# Altium project capstone_pcb.PrjPcb (part 2 of 2)

## Sheet comparator.SchDoc
size A
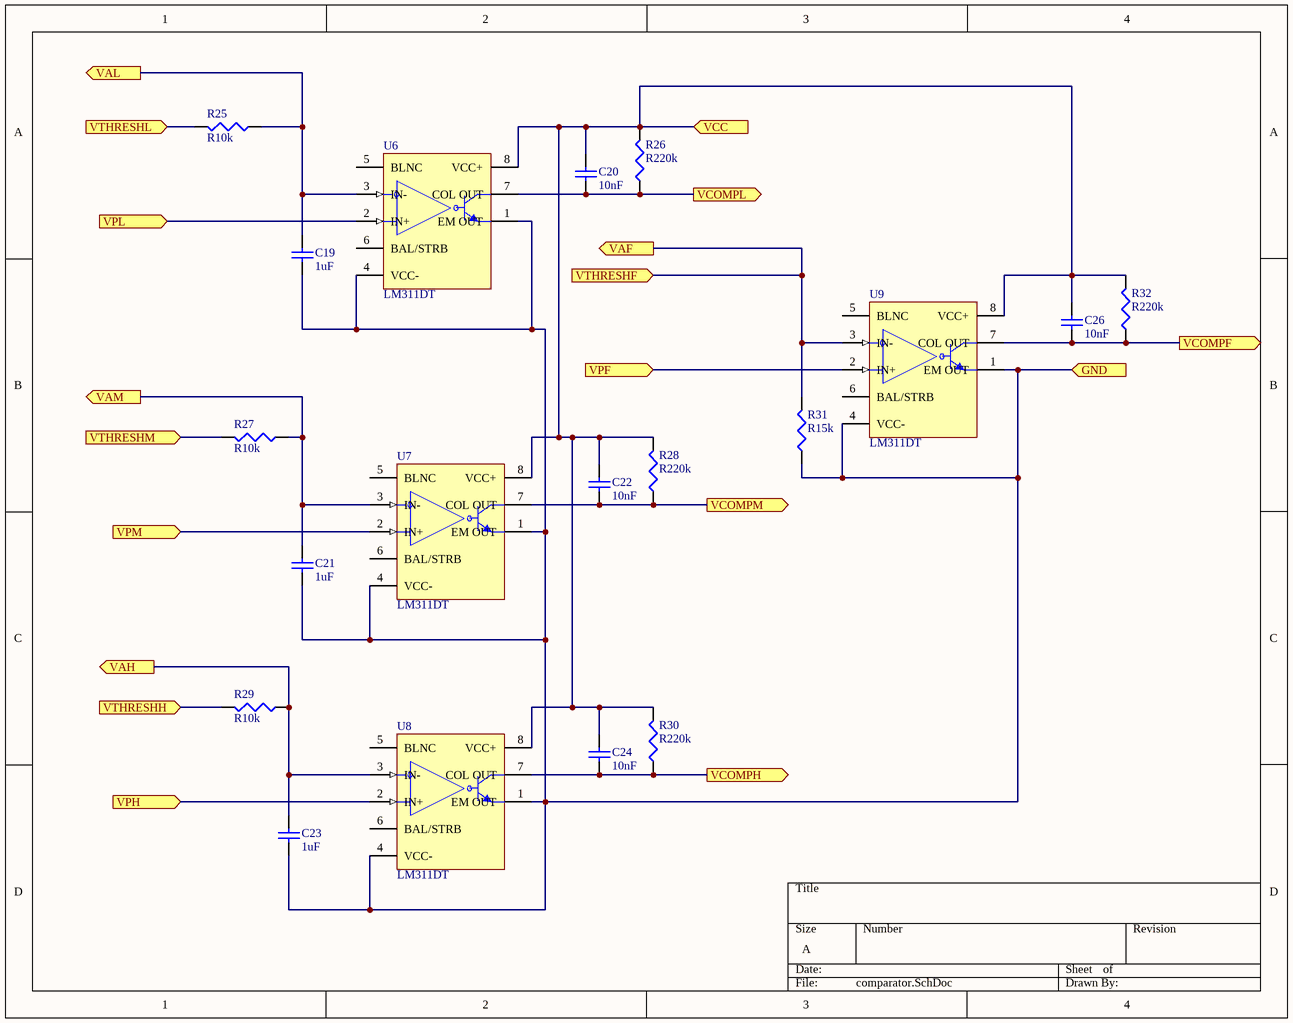
[diagram p6: comparator.SchDoc]

### Parts
C19  1uF  [C0603]
C20  10nF  [C0603]
C21  1uF  [C0603]
C22  10nF  [C0603]
C23  1uF  [C0603]
C24  10nF  [C0603]
C26  10nF  [C0603]
R25  R10k  [R0603]
R26  R220k  [R0603]
R27  R10k  [R0603]
R28  R220k  [R0603]
R29  R10k  [R0603]
R30  R220k  [R0603]
R31  R15k  [R0603]
R32  R220k  [R0603]
U6  LM311DT  [soic8]
U7  LM311DT  [soic8]
U8  LM311DT  [soic8]
U9  LM311DT  [soic8]

### Ports
GND (in), VAF (out), VAH (out), VAL (out), VAM (out), VCC (in), VCOMPF (out), VCOMPH (out), VCOMPL (out), VCOMPM (out), VPF (in), VPH (in), VPL (in), VPM (in), VTHRESHF (in), VTHRESHH (in), VTHRESHL (in), VTHRESHM (in)

### Nets
GND: C19.2 C21.2 C23.2 R31.1 U6.1(EM_OUT) U6.4(VCC-) U7.1(EM_OUT) U7.4(VCC-) U8.1(EM_OUT) U8.4(VCC-) U9.1(EM_OUT) U9.4(VCC-) ; port GND
VCC: C20.1 C22.1 C24.1 C26.1 R26.2 R28.2 R30.2 R32.2 U6.8(VCC+) U7.8(VCC+) U8.8(VCC+) U9.8(VCC+) ; port VCC
NetC19_1: C19.1 R25.1 U6.3(IN-) ; port VAL
NetC20_2: C20.2 R26.1 U6.7(COL_OUT) ; port VCOMPL
NetC21_1: C21.1 R27.1 U7.3(IN-) ; port VAM
NetC22_2: C22.2 R28.1 U7.7(COL_OUT) ; port VCOMPM
NetC23_1: C23.1 R29.1 U8.3(IN-) ; port VAH
NetC24_2: C24.2 R30.1 U8.7(COL_OUT) ; port VCOMPH
NetC26_2: C26.2 R32.1 U9.7(COL_OUT) ; port VCOMPF
NetC27_1: U6.2(IN+) ; port VPL
NetC28_1: U7.2(IN+) ; port VPM
NetC29_1: U8.2(IN+) ; port VPH
NetC30_1: U9.2(IN+) ; port VPF
NetR25_2: R25.2 ; port VTHRESHL
NetR27_2: R27.2 ; port VTHRESHM
NetR29_2: R29.2 ; port VTHRESHH
NetR31_2: R31.2 U9.3(IN-) ; port VTHRESHF, port VAF

Not connected (* = marked no-connect by the designer): U6 5(BLNC) 6(BAL/STRB); U7 5(BLNC) 6(BAL/STRB); U8 5(BLNC) 6(BAL/STRB); U9 5(BLNC) 6(BAL/STRB)

### Library data of the parts
C19 C21 C23 = C1uF: 1 uF Surface Mount Capacitor; Manufacturer: Murata Electronics North America; Manufacturer Part Number: GRM188R61C105KA93D; Capacitance: 1µF; Tolerance: ±10%; Voltage - Rated: 16V; Temperature Coefficient: X5R; Supplier 1: Digi-Key; RoHS: RoHS Compliant; Category: Capacitors; Stock 1: 1349645; Pricing 1: 1=0.1, 10=0.034, 50=0.0182, 100=0.0154, 250=0.0126, 500=0.01078, 1000=0.0084 (USD); Packaging: Digi-Reel®; Part Status: Active; Operating Temperature: -55°C ~ 85°C; Features: -; Ratings: -; Applications: General Purpose; Mounting Type: Surface Mount, MLCC; Package / Case: 0603 (1608 Metric); Size / Dimension: 0.063" L x 0.031" W (1.60mm x 0.80mm); Height - Seated (Max): -; Thickness (Max): 0.035" (0.90mm); Lead Spacing: -; Lead Style: -; ComponentLink1URL: http://www.murata.com/~/media/webrenewal/support/library/catalog/products/capacitor/mlcc/c02e.pdf; ComponentLink1Description: http://www.murata.com/~/media/webrenewal/support/library/catalog/products/capacitor/mlcc/c02e.pdf; Supplier Part Number 1: 490-1536-6-ND
C20 C22 C24 C26 = C10nF: 10 nF Surface Mount Capacitor; Manufacturer: Murata Electronics North America; Manufacturer Part Number: GRM188R70J103KA01D; Capacitance: 10000pF; Tolerance: ±10%; Voltage - Rated: 6.3V; Temperature Coefficient: X7R; Supplier 1: Digi-Key; RoHS: RoHS Compliant; Category: Capacitors; Stock 1: 37902; Pricing 1: 1=0.1, 10=0.049, 50=0.0266, 100=0.0226, 250=0.01844, 500=0.01578, 1000=0.0123 (USD); Packaging: Digi-Reel®; Part Status: Active; Operating Temperature: -55°C ~ 125°C; Features: -; Ratings: -; Applications: General Purpose; Mounting Type: Surface Mount, MLCC; Package / Case: 0603 (1608 Metric); Size / Dimension: 0.063" L x 0.031" W (1.60mm x 0.80mm); Height - Seated (Max): -; Thickness (Max): 0.035" (0.90mm); Lead Spacing: -; Lead Style: -; ComponentLink1URL: http://www.murata.com/~/media/webrenewal/support/library/catalog/products/capacitor/mlcc/c02e.pdf; ComponentLink1Description: http://www.murata.com/~/media/webrenewal/support/library/catalog/products/capacitor/mlcc/c02e.pdf; Supplier Part Number 1: 490-9729-6-ND
R25 R27 R29 = R10k: 10k Ohms Surface Mount Resistor; Manufacturer: Yageo; Manufacturer Part Number: RC0603FR-0710KL; Tolerance: ±1%; Power (Watts): 0.1W, 1/10W; Temperature Coefficient: ±100ppm/°C; Supplier 1: Digi-Key; RoHS: RoHS Compliant; Category: Resistors; Stock 1: 15519632; Pricing 1: 1=0.1, 10=0.013, 25=0.0092, 50=0.007, 100=0.0052, 250=0.00396, 500=0.00316, 1000=0.00233 (USD); Packaging: Digi-Reel®; Part Status: Active; Resistance (Ohms): 10k; Composition: Thick Film; Features: Moisture Resistant; Operating Temperature: -55°C ~ 155°C; Package / Case: 0603 (1608 Metric); Supplier Device Package: 0603; Size / Dimension: 0.063" L x 0.031" W (1.60mm x 0.80mm); Height - Seated (Max): 0.022" (0.55mm); Number of Terminations: 2; Failure Rate: -; ComponentLink1URL: http://www.yageo.com/NewPortal/yageodocoutput?fileName=/pdf/R-Chip/PYu-RC_Group_51_RoHS_L_4.pdf; ComponentLink1Description: http://www.yageo.com/NewPortal/yageodocoutput?fileName=/pdf/R-Chip/PYu-RC_Group_51_RoHS_L_4.pdf; Supplier Part Number 1: 311-10.0KHRDKR-ND
R26 R28 R30 R32 = R220k: 220k Ohms Surface Mount Resistor; Manufacturer: Yageo; Manufacturer Part Number: RC0603FR-07220KL; Tolerance: ±1%; Power (Watts): 0.1W, 1/10W; Temperature Coefficient: ±100ppm/°C; Supplier 1: Digi-Key; RoHS: RoHS Compliant; Category: Resistors; Stock 1: 712768; Pricing 1: 1=0.1, 10=0.013, 25=0.0092, 50=0.007, 100=0.0052, 250=0.00396, 500=0.00316, 1000=0.00233 (USD); Packaging: Digi-Reel®; Part Status: Active; Resistance (Ohms): 220k; Composition: Thick Film; Features: Moisture Resistant; Operating Temperature: -55°C ~ 155°C; Package / Case: 0603 (1608 Metric); Supplier Device Package: 0603; Size / Dimension: 0.063" L x 0.031" W (1.60mm x 0.80mm); Height - Seated (Max): 0.022" (0.55mm); Number of Terminations: 2; Failure Rate: -; ComponentLink1URL: http://www.yageo.com/NewPortal/yageodocoutput?fileName=/pdf/R-Chip/PYu-RC_Group_51_RoHS_L_4.pdf; ComponentLink1Description: http://www.yageo.com/NewPortal/yageodocoutput?fileName=/pdf/R-Chip/PYu-RC_Group_51_RoHS_L_4.pdf; Supplier Part Number 1: 311-220KHRDKR-ND
R31 = R15k: 15k Ohms Surface Mount Resistor; Manufacturer: Yageo; Manufacturer Part Number: RC0603FR-0715KL; Tolerance: ±1%; Power (Watts): 0.1W, 1/10W; Temperature Coefficient: ±100ppm/°C; Supplier 1: Digi-Key; RoHS: RoHS Compliant; Category: Resistors; Stock 1: 489455; Pricing 1: 1=0.1, 10=0.013, 25=0.0092, 50=0.007, 100=0.0052, 250=0.00396, 500=0.00316, 1000=0.00233 (USD); Packaging: Digi-Reel®; Part Status: Active; Resistance (Ohms): 15k; Composition: Thick Film; Features: Moisture Resistant; Operating Temperature: -55°C ~ 155°C; Package / Case: 0603 (1608 Metric); Supplier Device Package: 0603; Size / Dimension: 0.063" L x 0.031" W (1.60mm x 0.80mm); Height - Seated (Max): 0.022" (0.55mm); Number of Terminations: 2; Failure Rate: -; ComponentLink1URL: http://www.yageo.com/NewPortal/yageodocoutput?fileName=/pdf/R-Chip/PYu-RC_Group_51_RoHS_L_4.pdf; ComponentLink1Description: http://www.yageo.com/NewPortal/yageodocoutput?fileName=/pdf/R-Chip/PYu-RC_Group_51_RoHS_L_4.pdf; Supplier Part Number 1: 311-15.0KHRDKR-ND
U6-U9 = LM311DT: IC Comparator; Manufacturer: STMicroelectronics; Number of Elements: 1; Output Type: DTL, MOS, Open-Collector, Open-Emitter, RTL, TTL; Voltage - Supply, Single/Dual (±): 5 V ~ 30 V, ±2.5 V ~ 15 V; Voltage - Input Offset (Max): 7.5mV @ ±15V; Current - Input Bias (Max): 0.25µA @ ±15V; Current - Output (Typ): 50mA; Current - Quiescent (Max): 7.5mA; Supplier 1: Digi-Key; Manufacturer Part Number: LM311DT; RoHS: RoHS Compliant; Category: Integrated Circuits (ICs); Stock 1: 9481; Pricing 1: 1=0.39, 10=0.315, 100=0.2142, 500=0.16068, 1000=0.12051 (USD); Packaging: Cut Tape (CT); Part Status: Active; Type: General Purpose; CMRR, PSRR (Typ): -; Propagation Delay (Max): -; Hysteresis: -; Operating Temperature: 0°C ~ 70°C; Package / Case: 8-SOIC (0.154", 3.90mm Width); Mounting Type: Surface Mount; Supplier Device Package: 8-SO; ComponentLink1URL: http://www.st.com/content/ccc/resource/technical/document/datasheet/2d/22/50/0e/7e/39/43/64/CD00001072.pdf/files/CD00001072.pdf/jcr:content/translations/en.CD00001072.pdf; ComponentLink1Description: http://www.st.com/content/ccc/resource/technical/document/datasheet/2d/22/50/0e/7e/39/43/64/CD00001072.pdf/files/CD00001072.pdf/jcr:content/translations/en.CD00001072.pdf; Supplier Part Number 1: 497-1569-1-ND

## Sheet microphone_stage.SchDoc
size A
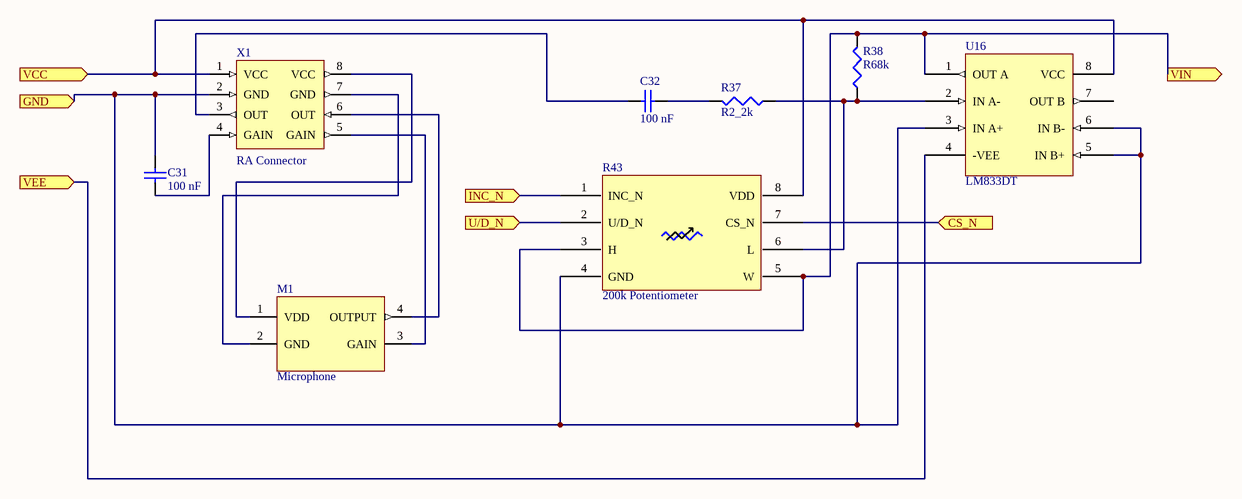
[diagram p7: microphone_stage.SchDoc]

### Parts
C31  100 nF  [C0603]
C32  100 nF  [C0603]
M1  Microphone  [SPU0414HR5H-SB-7]
R37  R2_2k  [R0603]
R38  R68k  [R0603]
R43  200k Potentiometer  [8-TSSOP]
U16  LM833DT  [soic8]
X1  RA Connector  [951104-7622-AR]

### Ports
CS_N (in), GND (in), INC_N (in), U/D_N (in), VCC (in), VEE (in), VIN (out)

### Nets
GND: C31.2 R43.4(GND) U16.3(IN_A+) U16.5(IN_B+) U16.6(IN_B-) X1.2(GND) ; port GND
VCC: R43.8(VDD) U16.8(VCC) X1.1(VCC) ; port VCC
NetC18_1: U16.4(-VEE) ; port VEE
NetC31_1: C31.1 X1.4(GAIN)
NetC32_1: C32.1 X1.3(OUT)
NetC32_2: C32.2 R37.2
NetM1_1: M1.1(VDD) X1.8(VCC)
NetM1_2: M1.2(GND) X1.7(GND)
NetM1_3: M1.3(GAIN) X1.5(GAIN)
NetM1_4: M1.4(OUTPUT) X1.6(OUT)
NetR1_1: R38.2 R43.3(H) R43.5(W) U16.1(OUT_A) ; port VIN
NetR37_1: R37.1 R38.1 R43.6(L) U16.2(IN_A-)
NetR43_1: R43.1(INC_N) ; port INC_N
NetR43_2: R43.2(U/D_N) ; port U/D_N
NetR43_7: R43.7(CS_N) ; port CS_N

Not connected (* = marked no-connect by the designer): U16 7(OUT_B)

### Library data of the parts
C31 C32 = C100nF: 100 nF Surface Mount Capacitor; Manufacturer: Murata Electronics North America; Manufacturer Part Number: GRM188R71C104KA01D; Capacitance: 0.10µF; Tolerance: ±10%; Voltage - Rated: 16V; Temperature Coefficient: X7R; Supplier 1: Digi-Key; RoHS: RoHS Compliant; Category: Capacitors; Stock 1: 4165009; Pricing 1: 1=0.1, 10=0.019, 50=0.0102, 100=0.0086, 250=0.00704, 500=0.006, 1000=0.00468 (USD); Packaging: Digi-Reel®; Part Status: Active; Operating Temperature: -55°C ~ 125°C; Features: -; Ratings: -; Applications: General Purpose; Mounting Type: Surface Mount, MLCC; Package / Case: 0603 (1608 Metric); Size / Dimension: 0.063" L x 0.031" W (1.60mm x 0.80mm); Height - Seated (Max): -; Thickness (Max): 0.035" (0.90mm); Lead Spacing: -; Lead Style: -; ComponentLink1URL: http://www.murata.com/~/media/webrenewal/support/library/catalog/products/capacitor/mlcc/c02e.pdf; ComponentLink1Description: http://www.murata.com/~/media/webrenewal/support/library/catalog/products/capacitor/mlcc/c02e.pdf; Supplier Part Number 1: 490-1532-6-ND
M1 = SPU0414HR5H-SB-7: MIC MEMS ANALOG OMNI -22DB; Manufacturer: Knowles; Direction: Omnidirectional; Frequency Range: 100Hz ~ 10kHz; Sensitivity: -22dB ±3dB @ 94dB SPL; S/N Ratio: 59dB; Impedance: 400 Ohm; Voltage Range: 1.5 ~ 3.6V; Current - Supply: 220µA; Port Location: Top; Seal Rating: None; Shape: Rectangular; Supplier 1: Digi-Key; Manufacturer Part Number: SPU0414HR5H-SB-7; RoHS: RoHS Compliant; Category: Audio Products; Stock 1: 124760; Pricing 1: 1=2.01, 10=1.748, 25=1.3596, 50=1.23, 100=1.1005, 250=1.06812, 500=1.03576, 1000=0.93866 (USD); Packaging: Digi-Reel®; Part Status: Active; Type: MEMS (Silicon); Output Type: Analog; Voltage - Rated: -; Termination: Surface Mount; Size / Dimension: 3.76mm L x 2.95mm W; Height (Max): 1.20mm; ComponentLink1URL: http://www.knowles.com/eng/content/download/3915/49630/version/7/file/SPU0414HR5H-SB.pdf; ComponentLink1Description: http://www.knowles.com/eng/content/download/3915/49630/version/7/file/SPU0414HR5H-SB.pdf; Supplier Part Number 1: 423-1134-6-ND
R37 = R2_2k: 2.2k Ohms Surface Mount Resistor; Manufacturer: Yageo; Manufacturer Part Number: RC0603FR-072K2L; Tolerance: ±1%; Power (Watts): 0.1W, 1/10W; Temperature Coefficient: ±100ppm/°C; Supplier 1: Digi-Key; RoHS: RoHS Compliant; Category: Resistors; Stock 1: 4524664; Pricing 1: 1=0.1, 10=0.013, 25=0.0092, 50=0.007, 100=0.0052, 250=0.00396, 500=0.00316, 1000=0.00233 (USD); Packaging: Digi-Reel®; Part Status: Active; Resistance (Ohms): 2.2k; Composition: Thick Film; Features: Moisture Resistant; Operating Temperature: -55°C ~ 155°C; Package / Case: 0603 (1608 Metric); Supplier Device Package: 0603; Size / Dimension: 0.063" L x 0.031" W (1.60mm x 0.80mm); Height - Seated (Max): 0.022" (0.55mm); Number of Terminations: 2; Failure Rate: -; ComponentLink1URL: http://www.yageo.com/NewPortal/yageodocoutput?fileName=/pdf/R-Chip/PYu-RC_Group_51_RoHS_L_4.pdf; ComponentLink1Description: http://www.yageo.com/NewPortal/yageodocoutput?fileName=/pdf/R-Chip/PYu-RC_Group_51_RoHS_L_4.pdf; Supplier Part Number 1: 311-2.20KHRDKR-ND
R38 = R68k: 68k Ohms Surface Mount Resistor; Manufacturer: Panasonic Electronic Components; Manufacturer Part Number: ERJ-3EKF6802V; Tolerance: ±1%; Power (Watts): 0.1W, 1/10W; Temperature Coefficient: ±100ppm/°C; Supplier 1: Digi-Key; RoHS: RoHS Compliant; Category: Resistors; Stock 1: 139857; Pricing 1: 1=0.1, 10=0.019, 25=0.0136, 50=0.0104, 100=0.0077, 250=0.00584, 500=0.00468, 1000=0.00345 (USD); Packaging: Cut Tape (CT); Part Status: Active; Resistance (Ohms): 68k; Composition: Thick Film; Features: Automotive AEC-Q200; Operating Temperature: -55°C ~ 155°C; Package / Case: 0603 (1608 Metric); Supplier Device Package: 0603; Size / Dimension: 0.063" L x 0.031" W (1.60mm x 0.80mm); Height - Seated (Max): 0.022" (0.55mm); Number of Terminations: 2; Failure Rate: -; ComponentLink1URL: https://industrial.panasonic.com/cdbs/www-data/pdf/RDA0000/AOA0000C283.pdf; ComponentLink1Description: https://industrial.panasonic.com/cdbs/www-data/pdf/RDA0000/AOA0000C283.pdf; Supplier Part Number 1: P68.0KHCT-ND
R43 = MAX5160NEUA: 200k Digital Potentiometer (32 Tap); Manufacturer: Maxim Integrated; Manufacturer Part Number: MAX5160NEUA+; Number of Circuits: 1; Number of Taps: 32; Interface: Up/Down (U/D, INC, CS); Memory Type: Volatile; Voltage - Supply: 2.7 V ~ 5.5 V; Tolerance: ±25%; Temperature Coefficient (Typ): 50 ppm/°C; Resistance - Wiper (Ohms) (Typ): 400; Supplier 1: Digi-Key; RoHS: RoHS Compliant; Category: Integrated Circuits (ICs); Stock 1: 274; Pricing 1: 1=0.87, 10=0.83 (USD); Packaging: Tube; Part Status: Active; Taper: Linear; Configuration: Potentiometer; Resistance (Ohms): 200k; Features: -; Operating Temperature: -40°C ~ 85°C; Package / Case: 8-TSSOP, 8-MSOP (0.118", 3.00mm Width); Supplier Device Package: 8-uMAX; ComponentLink1URL: https://datasheets.maximintegrated.com/en/ds/MAX5160-MAX5161.pdf; ComponentLink1Description: https://datasheets.maximintegrated.com/en/ds/MAX5160-MAX5161.pdf; Supplier Part Number 1: MAX5160NEUA+-ND
U16 = LM833DT: IC Dual Audio Amplifier; Manufacturer: STMicroelectronics; Number of Circuits: 2; Slew Rate: 7 V/µs; Gain Bandwidth Product: 15MHz; Current - Input Bias: 300nA; Voltage - Input Offset: 300µV; Current - Supply: 4mA; Voltage - Supply, Single/Dual (±): 5 V ~ 30 V, ±2.5 V ~ 15 V; Supplier 1: Digi-Key; Manufacturer Part Number: LM833DT; RoHS: RoHS Compliant; Category: Integrated Circuits (ICs); Stock 1: 35363; Pricing 1: 1=0.45, 10=0.382, 100=0.2855, 500=0.22434, 1000=0.17335 (USD); Packaging: Cut Tape (CT); Part Status: Active; Amplifier Type: Audio; Output Type: -; -3db Bandwidth: -; Current - Output / Channel: -; Operating Temperature: -40°C ~ 105°C; Mounting Type: Surface Mount; Package / Case: 8-SOIC (0.154", 3.90mm Width); Supplier Device Package: 8-SO; ComponentLink1URL: http://www.st.com/content/ccc/resource/technical/document/datasheet/3b/52/12/a5/70/7c/44/0a/CD00000470.pdf/files/CD00000470.pdf/jcr:content/translations/en.CD00000470.pdf; ComponentLink1Description: http://www.st.com/content/ccc/resource/technical/document/datasheet/3b/52/12/a5/70/7c/44/0a/CD00000470.pdf/files/CD00000470.pdf/jcr:content/translations/en.CD00000470.pdf; Supplier Part Number 1: 497-1597-1-ND
X1 = HPM-06-02-T-S-RA: Right Angle Board-to-Board Connector; Manufacturer: 3M; Connector Type: Header, Unshrouded; Number of Positions: 4; Number of Positions Loaded: All; Pitch: 0.079" (2.00mm); Supplier 1: Digi-Key; Manufacturer Part Number: 951104-7622-AR; RoHS: RoHS Compliant; Category: Connectors, Interconnects; Stock 1: 4791; Pricing 1: 1=0.41, 10=0.385, 25=0.33, 50=0.2806, 100=0.2695, 250=0.242, 500=0.231, 1000=0.1925, 2500=0.176 (USD); Packaging: Bulk; Part Status: Active; Number of Rows: 1; Row Spacing: -; Contact Mating Length: 0.173" (4.40mm); Mounting Type: Through Hole, Right Angle; Termination: Solder; Contact Finish: Gold; Contact Finish Thickness: Flash; Features: -; Color: Black; ComponentLink1URL: http://multimedia.3m.com/mws/media/438474O/3mtm-pin-strip-header-ts2156.pdf; ComponentLink1Description: http://multimedia.3m.com/mws/media/438474O/3mtm-pin-strip-header-ts2156.pdf; Supplier Part Number 1: 3M9306-ND; Contact Type: Male Pin; Fastening Type: -

## Sheet envelope.SchDoc
size A
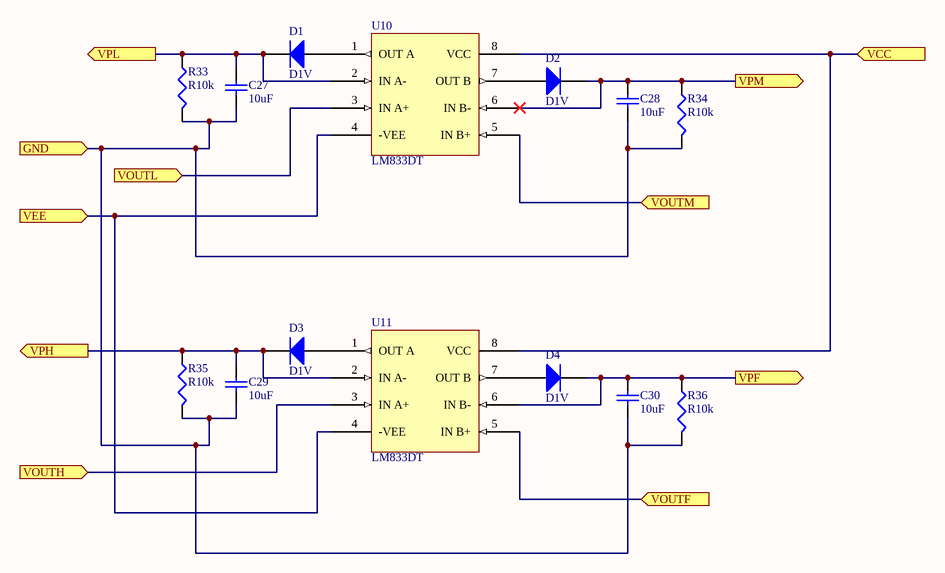
[diagram p8: envelope.SchDoc]

### Parts
C27  10uF  [C0603]
C28  10uF  [C0603]
C29  10uF  [C0603]
C30  10uF  [C0603]
D1  D1V  [D1206]
D2  D1V  [D1206]
D3  D1V  [D1206]
D4  D1V  [D1206]
R33  R10k  [R0603]
R34  R10k  [R0603]
R35  R10k  [R0603]
R36  R10k  [R0603]
U10  LM833DT  [soic8]
U11  LM833DT  [soic8]

### Ports
GND (in), VCC (in), VEE (in), VOUTF (in), VOUTH (in), VOUTL (in), VOUTM (in), VPF (out), VPH (out), VPL (out), VPM (out)

### Nets
GND: C27.2 C28.2 C29.2 C30.2 R33.2 R34.2 R35.2 R36.2 ; port GND
VCC: U10.8(VCC) U11.8(VCC) ; port VCC
NetC3_1: U10.3(IN_A+) ; port VOUTL
NetC7_1: U10.5(IN_B+) ; port VOUTM
NetC11_1: U11.3(IN_A+) ; port VOUTH
NetC15_1: U11.5(IN_B+) ; port VOUTF
NetC18_1: U10.4(-VEE) U11.4(-VEE) ; port VEE
NetC27_1: C27.1 D1.2(K) R33.1 U10.2(IN_A-) ; port VPL
NetC28_1: C28.1 D2.2(K) R34.1 U10.6(IN_B-) ; port VPM
NetC29_1: C29.1 D3.2(K) R35.1 U11.2(IN_A-) ; port VPH
NetC30_1: C30.1 D4.2(K) R36.1 U11.6(IN_B-) ; port VPF
NetD1_1: D1.1(A) U10.1(OUT_A)
NetD2_1: D2.1(A) U10.7(OUT_B)
NetD3_1: D3.1(A) U11.1(OUT_A)
NetD4_1: D4.1(A) U11.7(OUT_B)

### Library data of the parts
C27-C30 = C10uF: 10 uF Surface Mount Capacitor; Manufacturer: Yageo; Manufacturer Part Number: CC0603KRX5R5BB106; Capacitance: 10µF; Tolerance: ±10%; Voltage - Rated: 6.3V; Temperature Coefficient: X5R; Supplier 1: Digi-Key; RoHS: RoHS Compliant; Category: Capacitors; Stock 1: 18386; Pricing 1: 1=0.27, 10=0.186, 25=0.1488, 50=0.124, 100=0.1054, 250=0.08368, 500=0.0744, 1000=0.06509 (USD); Packaging: Digi-Reel®; Part Status: Active; Operating Temperature: -55°C ~ 85°C; Features: -; Ratings: -; Applications: General Purpose; Mounting Type: Surface Mount, MLCC; Package / Case: 0603 (1608 Metric); Size / Dimension: 0.063" L x 0.031" W (1.60mm x 0.80mm); Height - Seated (Max): -; Thickness (Max): 0.035" (0.90mm); Lead Spacing: -; Lead Style: -; ComponentLink1URL: http://www.yageo.com/documents/recent/UPY-GPHC_X5R_4V-to-50V_23.pdf; ComponentLink1Description: http://www.yageo.com/documents/recent/UPY-GPHC_X5R_4V-to-50V_23.pdf; Failure Rate: -; Supplier Part Number 1: 311-1781-6-ND
D1-D4 = D1V: Standard 1V Diode; Manufacturer: Bourns Inc.; Manufacturer Part Number: CD1206-S01575; Voltage - DC Reverse (Vr) (Max): 100V; Current - Average Rectified (Io): 150mA; Voltage - Forward (Vf) (Max) @ If: 1V @ 50mA; Speed: Small Signal =< 200mA (Io), Any Speed; Reverse Recovery Time (trr): 4ns; Current - Reverse Leakage @ Vr: 2.5µA @ 100V; Capacitance @ Vr, F: 3pF @ 0V, 100MHz; Supplier 1: Digi-Key; RoHS: RoHS Compliant; Category: Discrete Semiconductor Products; Stock 1: 122779; Pricing 1: 1=0.15, 10=0.142, 25=0.1288, 100=0.0927, 250=0.0546, 500=0.04532, 1000=0.0309, 2500=0.02626 (USD); Packaging: Cut Tape (CT); Part Status: Active; Diode Type: Standard; Mounting Type: Surface Mount; Package / Case: 1206 (3216 Metric); Supplier Device Package: 1206; Operating Temperature - Junction: -55°C ~ 125°C; ComponentLink1URL: http://www.bourns.com/docs/Product-Datasheets/CD1206_S01575.pdf; ComponentLink1Description: http://www.bourns.com/docs/Product-Datasheets/CD1206_S01575.pdf; Supplier Part Number 1: CD1206-S01575CT-ND
R33-R36 = R10k: as R25 on sheet comparator; Supplier 1: Digi-Key; RoHS: RoHS Compliant; Category: Resistors; Stock 1: 15519632; Pricing 1: 1=0.1, 10=0.013, 25=0.0092, 50=0.007, 100=0.0052, 250=0.00396, 500=0.00316, 1000=0.00233 (USD); Packaging: Digi-Reel®; Part Status: Active; Resistance (Ohms): 10k; Composition: Thick Film; Features: Moisture Resistant; Operating Temperature: -55°C ~ 155°C; Package / Case: 0603 (1608 Metric); Supplier Device Package: 0603; Size / Dimension: 0.063" L x 0.031" W (1.60mm x 0.80mm); Height - Seated (Max): 0.022" (0.55mm); Number of Terminations: 2; Failure Rate: -; ComponentLink1URL: http://www.yageo.com/NewPortal/yageodocoutput?fileName=/pdf/R-Chip/PYu-RC_Group_51_RoHS_L_4.pdf; ComponentLink1Description: http://www.yageo.com/NewPortal/yageodocoutput?fileName=/pdf/R-Chip/PYu-RC_Group_51_RoHS_L_4.pdf; Supplier Part Number 1: 311-10.0KHRDKR-ND
U10 U11 = LM833DT: as U16 on sheet microphone_stage; Supplier 1: Digi-Key; Manufacturer Part Number: LM833DT; RoHS: RoHS Compliant; Category: Integrated Circuits (ICs); Stock 1: 35363; Pricing 1: 1=0.45, 10=0.382, 100=0.2855, 500=0.22434, 1000=0.17335 (USD); Packaging: Cut Tape (CT); Part Status: Active; Amplifier Type: Audio; Output Type: -; -3db Bandwidth: -; Current - Output / Channel: -; Operating Temperature: -40°C ~ 105°C; Mounting Type: Surface Mount; Package / Case: 8-SOIC (0.154", 3.90mm Width); Supplier Device Package: 8-SO; ComponentLink1URL: http://www.st.com/content/ccc/resource/technical/document/datasheet/3b/52/12/a5/70/7c/44/0a/CD00000470.pdf/files/CD00000470.pdf/jcr:content/translations/en.CD00000470.pdf; ComponentLink1Description: http://www.st.com/content/ccc/resource/technical/document/datasheet/3b/52/12/a5/70/7c/44/0a/CD00000470.pdf/files/CD00000470.pdf/jcr:content/translations/en.CD00000470.pdf; Supplier Part Number 1: 497-1597-1-ND

## Sheet PSOC.SchDoc
size A
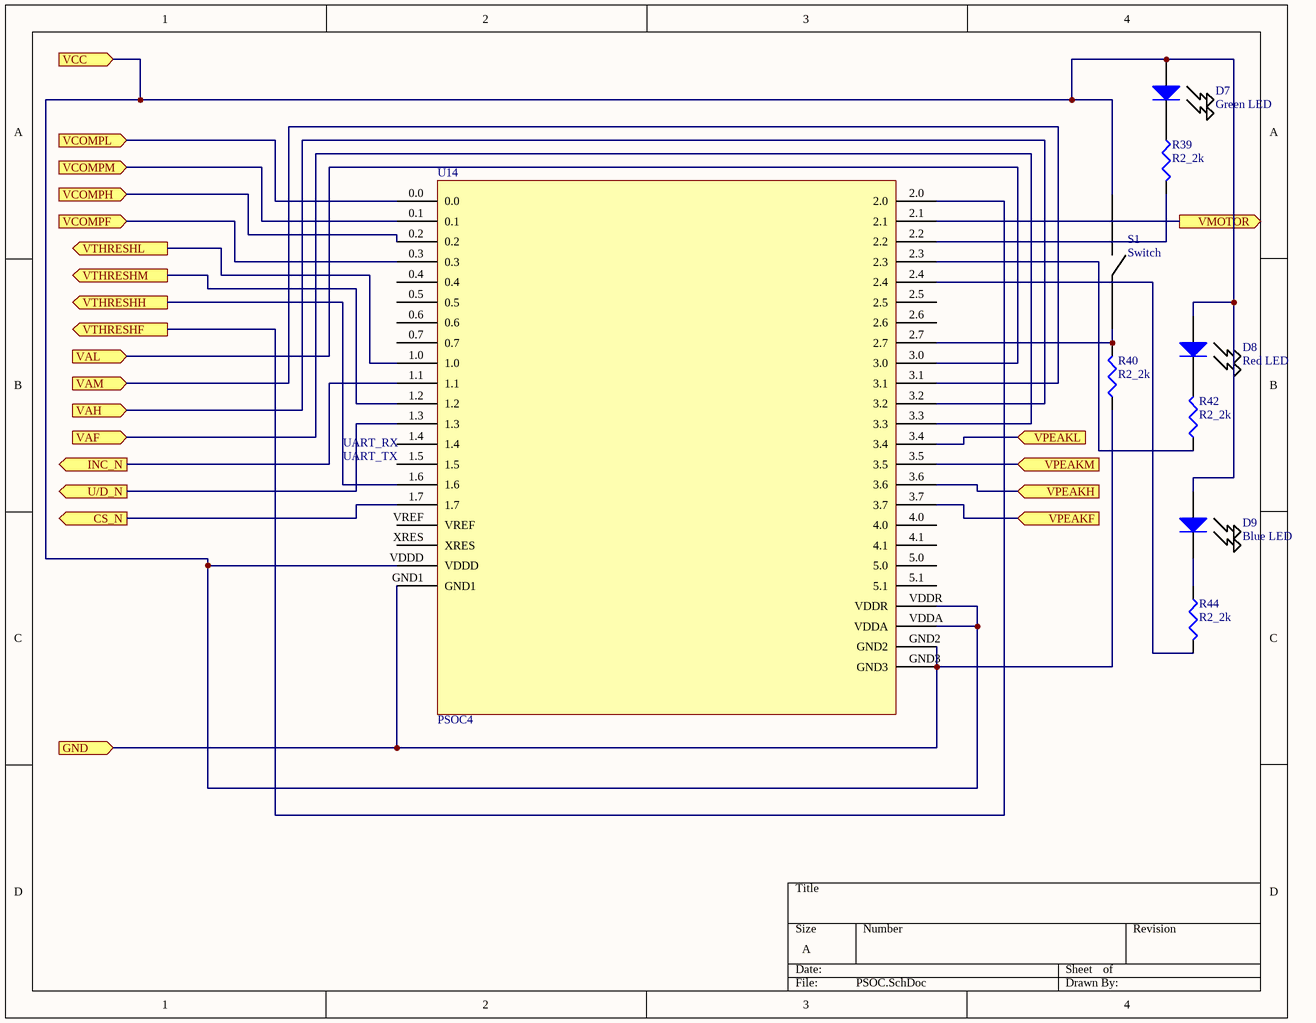
[diagram p9: PSOC.SchDoc]

### Parts
D7  Green LED  [MLEGRN-A1]
D8  Red LED  [MLERED-A1]
D9  Blue LED  [MLEBLU-A1]
R39  R2_2k  [R0603]
R40  R2_2k  [R0603]
R42  R2_2k  [R0603]
R44  R2_2k  [R0603]
S1  Switch  [CHS-01TB]
U14  PSOC4  [PSOC4XXX-BLE]

### Ports
CS_N (out), GND (in), INC_N (out), U/D_N (out), VAF (in), VAH (in), VAL (in), VAM (in), VCC (in), VCOMPF (in), VCOMPH (in), VCOMPL (in), VCOMPM (in), VMOTOR (out), VPEAKF (in), VPEAKH (in), VPEAKL (in), VPEAKM (in), VTHRESHF (out), VTHRESHH (out), VTHRESHL (out), VTHRESHM (out)

### Nets
GND: R40.1 U14.GND1 U14.GND2 U14.GND3 ; port GND
VCC: D7.A D8.A D9.A S1.1 U14.VDDA U14.VDDD U14.VDDR ; port VCC
NetC19_1: U14.3.0 ; port VAL
NetC20_2: U14.0.0 ; port VCOMPL
NetC21_1: U14.3.1 ; port VAM
NetC22_2: U14.0.1 ; port VCOMPM
NetC23_1: U14.3.2 ; port VAH
NetC24_2: U14.0.2 ; port VCOMPH
NetC26_2: U14.0.3 ; port VCOMPF
NetC27_1: U14.3.4 ; port VPEAKL
NetC28_1: U14.3.5 ; port VPEAKM
NetC29_1: U14.3.6 ; port VPEAKH
NetC30_1: U14.3.7 ; port VPEAKF
NetD7_C: D7.C R39.1
NetD8_C: D8.C R42.2
NetD9_C: D9.C R44.1
NetQ1_1: U14.2.1 ; port VMOTOR
NetR25_2: U14.1.0 ; port VTHRESHL
NetR27_2: U14.1.2 ; port VTHRESHM
NetR29_2: U14.1.6 ; port VTHRESHH
NetR31_2: U14.2.0 U14.3.3 ; port VTHRESHF, port VAF
NetR39_2: R39.2 U14.2.2
NetR40_2: R40.2 S1.2 U14.2.7
NetR42_1: R42.1 U14.2.3
NetR43_1: U14.1.1 ; port INC_N
NetR43_2: U14.1.3 ; port U/D_N
NetR43_7: U14.1.7 ; port CS_N
NetR44_2: R44.2 U14.2.4

Not connected (* = marked no-connect by the designer): U14 0.4 0.5 0.6 0.7 1.4 1.5 2.5 2.6 4.0 4.1 5.0 5.1 VREF XRES

### Notes on the sheet
- (near U14) UART_TX
- (near U14) UART_RX

### Library data of the parts
D7 = LED_G: Manufacturer: Cree Inc.; Manufacturer Part Number: MLEGRN-A1-0000-000001; Wavelength: 528nm (520nm ~ 535nm); Current - Test: 150mA; Voltage - Forward (Vf) (Typ): 3.3V; Lumens/Watt @ Current - Test: 67 lm/W; Current - Max: 350mA; Flux @ Current/Temperature - Test: 33 lm (31 lm ~ 35 lm); Temperature - Test: 25°C; Viewing Angle: 125°; Thermal Resistance of Package: 15°C/W; Supplier 1: Digi-Key; RoHS: RoHS Compliant; Category: Optoelectronics; Stock 1: 2607; Pricing 1: 1=1.34, 100=1.1891, 250=1.08572, 500=0.9823 (USD); Packaging: Cut Tape (CT); Part Status: Active; Color: Green; Mounting Type: Surface Mount; Package / Case: 4-SMD, J-Lead Exposed Pad; ComponentLink1URL: http://www.cree.com/~/media/Files/Cree/LED%20Components%20and%20Modules/XLamp/Data%20and%20Binning/XlampMLE.pdf; ComponentLink1Description: http://www.cree.com/~/media/Files/Cree/LED%20Components%20and%20Modules/XLamp/Data%20and%20Binning/XlampMLE.pdf; Supplier Part Number 1: MLEGRN-A1-0000-000001CT-ND
D8 = LED_R: Manufacturer: Cree Inc.; Manufacturer Part Number: MLERED-A1-0000-000V01; Wavelength: 625nm (620nm ~ 630nm); Current - Test: 150mA; Voltage - Forward (Vf) (Typ): 2.4V; Lumens/Watt @ Current - Test: 58 lm/W; Current - Max: 350mA; Flux @ Current/Temperature - Test: 21 lm (18 lm ~ 24 lm); Temperature - Test: 25°C; Viewing Angle: 120°; Thermal Resistance of Package: 15°C/W; Supplier 1: Digi-Key; RoHS: RoHS Compliant; Category: Optoelectronics; Stock 1: 7000; Pricing 1: 1=1.2, 100=1.0626, 250=0.9702, 500=0.8778 (USD); Packaging: Cut Tape (CT); Part Status: Active; Color: Red; Mounting Type: Surface Mount; Package / Case: 4-SMD, J-Lead Exposed Pad; ComponentLink1URL: http://www.cree.com/~/media/Files/Cree/LED%20Components%20and%20Modules/XLamp/Data%20and%20Binning/XlampMLE.pdf; ComponentLink1Description: http://www.cree.com/~/media/Files/Cree/LED%20Components%20and%20Modules/XLamp/Data%20and%20Binning/XlampMLE.pdf; Supplier Part Number 1: MLERED-A1-0000-000V01CT-ND
D9 = LED_B: Manufacturer: Cree Inc.; Manufacturer Part Number: MLEBLU-A1-0000-000T01; Wavelength: 475nm (465nm ~ 485nm); Current - Test: 150mA; Voltage - Forward (Vf) (Typ): 3.2V; Lumens/Watt @ Current - Test: 27 lm/W; Current - Max: 350mA; Flux @ Current/Temperature - Test: 13 lm (11 lm ~ 14 lm); Temperature - Test: 25°C; Viewing Angle: 125°; Thermal Resistance of Package: 11°C/W; Supplier 1: Digi-Key; RoHS: RoHS Compliant; Category: Optoelectronics; Stock 1: 13229; Pricing 1: 1=0.8, 10=0.76, 50=0.7384, 100=0.68, 200=0.6184, 500=0.5792 (USD); Packaging: Cut Tape (CT); Part Status: Active; Color: Blue; Mounting Type: Surface Mount; Package / Case: 4-SMD, J-Lead Exposed Pad; Supplier Device Package: SMD; Size / Dimension: 0.138" L x 0.124" W (3.50mm x 3.15mm); Height - Seated (Max): 0.052" (1.33mm); ComponentLink1URL: http://www.cree.com/~/media/Files/Cree/LED%20Components%20and%20Modules/XLamp/Data%20and%20Binning/XlampMLE.pdf; ComponentLink1Description: http://www.cree.com/~/media/Files/Cree/LED%20Components%20and%20Modules/XLamp/Data%20and%20Binning/XlampMLE.pdf; Supplier Part Number 1: MLEBLU-A1-0000-000T01CT-ND
R39 R40 R42 R44 = R2_2k: as R37 on sheet microphone_stage; Supplier 1: Digi-Key; RoHS: RoHS Compliant; Category: Resistors; Stock 1: 4524664; Pricing 1: 1=0.1, 10=0.013, 25=0.0092, 50=0.007, 100=0.0052, 250=0.00396, 500=0.00316, 1000=0.00233 (USD); Packaging: Digi-Reel®; Part Status: Active; Resistance (Ohms): 2.2k; Composition: Thick Film; Features: Moisture Resistant; Operating Temperature: -55°C ~ 155°C; Package / Case: 0603 (1608 Metric); Supplier Device Package: 0603; Size / Dimension: 0.063" L x 0.031" W (1.60mm x 0.80mm); Height - Seated (Max): 0.022" (0.55mm); Number of Terminations: 2; Failure Rate: -; ComponentLink1URL: http://www.yageo.com/NewPortal/yageodocoutput?fileName=/pdf/R-Chip/PYu-RC_Group_51_RoHS_L_4.pdf; ComponentLink1Description: http://www.yageo.com/NewPortal/yageodocoutput?fileName=/pdf/R-Chip/PYu-RC_Group_51_RoHS_L_4.pdf; Supplier Part Number 1: 311-2.20KHRDKR-ND
S1 = Switch: Surface Mount Switch; Manufacturer: Copal Electronics Inc.; Circuit: SPST; Number of Positions: 1; Current Rating: 100mA; Voltage Rating: 6VDC; Actuator Type: Slide (Standard); Actuator Level: Flush, Recessed; Pitch: 0.050" (1.27mm), Half; Washable: Yes; Body Material: Polyphenylene Sulfide (PPS); Electrical Life: 2,000 Cycles; Supplier 1: Digi-Key; Manufacturer Part Number: CHS-01TB; RoHS: RoHS Compliant; Category: Switches; Stock 1: 50184; Pricing 1: 1=0.97, 10=0.952, 25=0.8976, 50=0.8424, 100=0.8059, 250=0.76924, 500=0.69598 (USD); Packaging: Digi-Reel®; Part Status: Active; Contact Material: Copper Alloy; Contact Finish: Gold; Height Above Board: 0.098" (2.50mm); Mounting Type: Surface Mount; Termination Style: Gull Wing; Features: Tape Seal; Length: 0.098" (2.50mm); Operating Temperature: -40°C ~ 85°C; Mechanical Life: -; ComponentLink1URL: http://www.nidec-copal-electronics.com/e/catalog/switch/chs.pdf; ComponentLink1Description: http://www.nidec-copal-electronics.com/e/catalog/switch/chs.pdf; Supplier Part Number 1: 563-1004-6-ND
U14 = PSOC4: PSOC4 Connector; Manufacturer: JST Sales America Inc.; Manufacturer Part Number: B14B-PH-K-S(LF)(SN); Connector Type: Header, Shrouded; Pitch: 0.079" (2.00mm); Number of Positions: 14; Number of Positions Loaded: All; Supplier 1: Digi-Key; RoHS: RoHS Compliant; Category: Connectors, Interconnects; Stock 1: 1457; Pricing 1: 1=0.63, 10=0.592, 100=0.4536, 500=0.39444, 1000=0.32542, 5000=0.28597, 10000=0.26625 (USD); Packaging: Bulk; Part Status: Active; Contact Type: Male Pin; Number of Rows: 1; Row Spacing: -; Mounting Type: Through Hole; Termination: Press-Fit, Solder; Fastening Type: Detent Lock; Contact Mating Length: 0.130" (3.30mm); Features: -; Contact Finish: Tin; Contact Finish Thickness: -; Color: Natural; ComponentLink1URL: http://www.jst-mfg.com/product/pdf/eng/ePH.pdf; ComponentLink1Description: http://www.jst-mfg.com/product/pdf/eng/ePH.pdf; Supplier Part Number 1: 455-1716-ND

## Nets that join several sheets
GND: top (C35.1 Q1.3 R41.1 U13.2), low_filter (R2.1 R6.1 U1.3 U1.5), med_filter (R8.1 R12.1 U2.3 U2.5), high_filter (R14.1 R18.1 U3.3 U3.5), fire_filter (R20.1 R24.1 U4.3 U4.5), voltage_inverter (7 pins), comparator (12 pins), microphone_stage (6 pins), envelope (8 pins), PSOC (R40.1 U14.GND1 U14.GND2 U14.GND3)
VCC: top (5 pins), low_filter (U1.8), med_filter (U2.8), high_filter (U3.8), fire_filter (U4.8), voltage_inverter (U5.8 U15.8), comparator (12 pins), microphone_stage (R43.8 U16.8 X1.1), envelope (U10.8 U11.8), PSOC (7 pins)
NetC3_1: low_filter (C3.1 R5.2 U1.7), envelope (U10.3)
NetC7_1: med_filter (C7.1 R11.2 U2.7), envelope (U10.5)
NetC11_1: high_filter (C11.1 R17.2 U3.7), envelope (U11.3)
NetC15_1: fire_filter (C15.1 R23.2 U4.7), envelope (U11.5)
NetC18_1: low_filter (U1.4), med_filter (U2.4), high_filter (U3.4), fire_filter (U4.4), voltage_inverter (5 pins), microphone_stage (U16.4), envelope (U10.4 U11.4)
NetC19_1: comparator (C19.1 R25.1 U6.3), PSOC (U14.3.0)
NetC20_2: comparator (C20.2 R26.1 U6.7), PSOC (U14.0.0)
NetC21_1: comparator (C21.1 R27.1 U7.3), PSOC (U14.3.1)
NetC22_2: comparator (C22.2 R28.1 U7.7), PSOC (U14.0.1)
NetC23_1: comparator (C23.1 R29.1 U8.3), PSOC (U14.3.2)
NetC24_2: comparator (C24.2 R30.1 U8.7), PSOC (U14.0.2)
NetC26_2: comparator (C26.2 R32.1 U9.7), PSOC (U14.0.3)
NetC27_1: comparator (U6.2), envelope (C27.1 D1.2 R33.1 U10.2), PSOC (U14.3.4)
NetC28_1: comparator (U7.2), envelope (C28.1 D2.2 R34.1 U10.6), PSOC (U14.3.5)
NetC29_1: comparator (U8.2), envelope (C29.1 D3.2 R35.1 U11.2), PSOC (U14.3.6)
NetC30_1: comparator (U9.2), envelope (C30.1 D4.2 R36.1 U11.6), PSOC (U14.3.7)
NetQ1_1: top (Q1.1 R41.2), PSOC (U14.2.1)
NetR1_1: low_filter (R1.1), med_filter (R7.1), high_filter (R13.1), fire_filter (R19.1), microphone_stage (R38.2 R43.3 R43.5 U16.1)
NetR25_2: comparator (R25.2), PSOC (U14.1.0)
NetR27_2: comparator (R27.2), PSOC (U14.1.2)
NetR29_2: comparator (R29.2), PSOC (U14.1.6)
NetR31_2: comparator (R31.2 U9.3), PSOC (U14.2.0 U14.3.3)
NetR43_1: microphone_stage (R43.1), PSOC (U14.1.1)
NetR43_2: microphone_stage (R43.2), PSOC (U14.1.3)
NetR43_7: microphone_stage (R43.7), PSOC (U14.1.7)